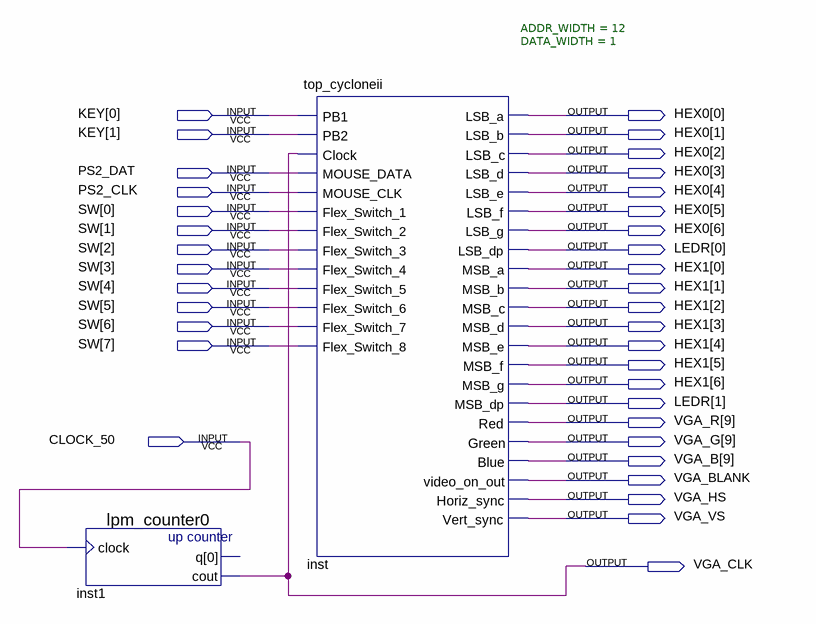
[diagram p0: schematic sheet]
// Quartus schematic MIPS_DE2.bdf as structural Verilog: 2 symbols, 36 pins
module MIPS_DE2 (
  input  [1:0] KEY,
  input  PS2_DAT,
  input  PS2_CLK,
  input  [7:0] SW,
  input  CLOCK_50,
  output [6:0] HEX0,
  output [1:0] LEDR,
  output [6:0] HEX1,
  output [9:9] VGA_R,
  output [9:9] VGA_G,
  output [9:9] VGA_B,
  output VGA_BLANK,
  output VGA_HS,
  output VGA_VS,
  output VGA_CLK
);

  lpm_counter0 inst1 (.clock(CLOCK_50), .cout(VGA_CLK));  // open: q
  top_cycloneii #(.ADDR_WIDTH(12), .DATA_WIDTH(1)) inst (
    .PB1(KEY[0]), .PB2(KEY[1]), .Clock(VGA_CLK), .MOUSE_DATA(PS2_DAT), .MOUSE_CLK(PS2_CLK),
    .Flex_Switch_1(SW[0]), .Flex_Switch_2(SW[1]), .Flex_Switch_3(SW[2]), .Flex_Switch_4(SW[3]),
    .Flex_Switch_5(SW[4]), .Flex_Switch_6(SW[5]), .Flex_Switch_7(SW[6]), .Flex_Switch_8(SW[7]),
    .LSB_a(HEX0[0]), .LSB_b(HEX0[1]), .LSB_c(HEX0[2]), .LSB_d(HEX0[3]), .LSB_e(HEX0[4]), .LSB_f(HEX0[5]),
    .LSB_g(HEX0[6]), .LSB_dp(LEDR[0]), .MSB_a(HEX1[0]), .MSB_b(HEX1[1]), .MSB_c(HEX1[2]), .MSB_d(HEX1[3]),
    .MSB_e(HEX1[4]), .MSB_f(HEX1[5]), .MSB_g(HEX1[6]), .MSB_dp(LEDR[1]), .Red(VGA_R[9]), .Green(VGA_G[9]),
    .Blue(VGA_B[9]), .video_on_out(VGA_BLANK), .Horiz_sync(VGA_HS), .Vert_sync(VGA_VS));
endmodule
